# Altium schematic sheet RADC-CANBUS-S03-V00.SchDoc: RADC CANBUS (CAN2.0B, ESD Protection, LED Indicators)
size A3; DrawnBy: Jonn Dillon; DocumentNumber: 7; SheetNumber: 7; SheetTotal: 8; Version: 00; Project: QUTMS RADIO COMPUTE; PageSetup: Record=PageOptions|CenterHorizontal=True|CenterVertical=True|PrintScale=0.97|XCorrection=1.00|YCorrection=1.00|PrintKind=0|BorderSize=5000000|LeftOffset=0|BottomOffset=0|Orientation=2|PaperLength=1000|PaperWidth=1000|Scale=100|PaperSource=7|PrintQuality=-4|MediaType=1|DitherType=10|PaperKind=A4|PrintScaleMode=1
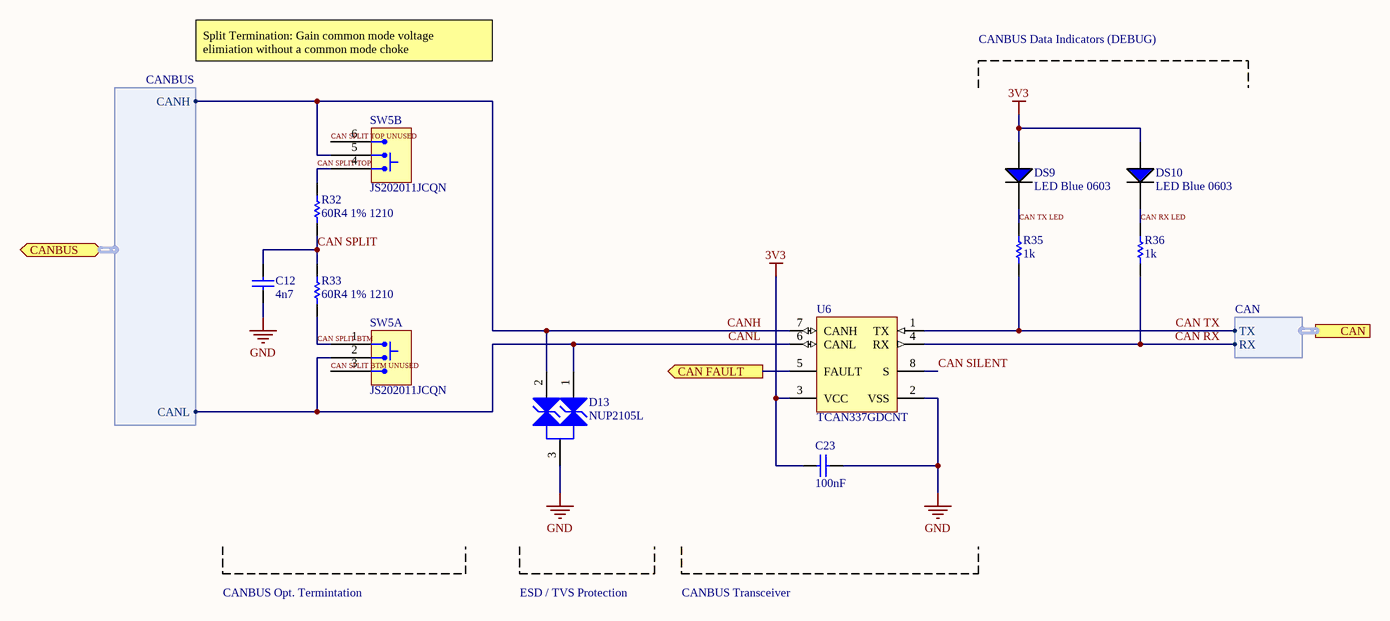
[diagram p0: RADC-CANBUS-S03-V00.SchDoc]

## Parts
C12  4n7  [Cap_Ceramic_0603]
C23  100nF  [Cap_Ceramic_0603]
D13  NUP2105L  [NUP2105L]
DS9  LED Blue 0603  [LED BLUE 0603]
DS10  LED Blue 0603  [LED BLUE 0603]
R32  60R4 1% 1210  [Res_ThinFilm_1210]
R33  60R4 1% 1210  [Res_ThinFilm_1210]
R35  1k  [Res_ThinFilm_0603]
R36  1k  [Res_ThinFilm_0603]
SW5  JS202011JCQN  [JS202011JCQN]  (parts A,B of 2)
U6  TCAN337GDCNT  [SOT-23-8]

## Ports
CAN (harness CAN), CAN FAULT (out), CANBUS (bidir, harness CANBUS)

## Harnesses
CAN: RX, TX
CANBUS: CANH, CANL

## Nets
3V3: C23.1 DS9.1(A) DS10.1(A) U6.3(VCC)
GND: C12.1 C23.2 D13.3 U6.2(VSS)
CAN FAULT: U6.5(FAULT) ; port CAN FAULT
CAN RX: R36.1 U6.4(RX) ; port CAN.RX
CAN RX LED: DS10.2(C) R36.2
CAN SILENT: U6.8(S)
CAN SPLIT: C12.2 R32.1 R33.2
CAN SPLIT BTM: R33.1 SW5.1
CAN SPLIT BTM UNUSED: SW5.3
CAN SPLIT TOP: R32.2 SW5.4
CAN SPLIT TOP UNUSED: SW5.6
CAN TX: R35.1 U6.1(TX) ; port CAN.TX
CAN TX LED: DS9.2(C) R35.2
CANH: D13.2 SW5.5 U6.7(CANH) ; port CANBUS.CANH
CANL: D13.1 SW5.2 U6.6(CANL) ; port CANBUS.CANL

## Notes on the sheet
- Split Termination: Gain common mode voltage elimiation without a common mode choke
- CANBUS Data Indicators (DEBUG)
- CANBUS Opt. Termintation
- ESD / TVS Protection
- CANBUS Transceiver
- Revision History:
- Sheet Title:
- Rev
- Date
- Description
- Project:
- Size:
- Drawn By:
- A3
- Number:
- Revision:
- Sheet
- Version:
- of
- QUT Motorsport
- O-120, Gardens Point
- 2 George Street
- Brisbane, QLD 4000
- Australia
- Print Date:
- Print Time:
- File Name:

## Library data of the parts
C12 = 4n7 50V 5% X7R 0603: Capacitor, Ceramic, SMD, 4n7, 50V, 5%, X7R, 0603
C23 = 100nF 50V 5% X7R 0603: Capacitor, Ceramic, SMD, 100nF, 50V, 5%, X7R, 0603
R32 R33 = 60R4 1% 1210: Resistor, SMD, 60R4, 0.25W, 1%, 1210
R35 R36 = 1k 5% 0603: Resistor, SMD, 1k, 0.1W, 5%, 0603
SW5 = SLIDE DPDT JS202011JCQN
U6 = TCAN337GDCNT: 1/1 Transceiver CANbus SOT-23-8
D13 = NUP2105L: ComponentLink1Description: Datasheet; ComponentLink1URL: https://www.onsemi.cn/PowerSolutions/document/NUP2105L-D.PDF; Parameter 1: *; ComponentLink2Description: LCSC; ComponentLink2URL: https://lcsc.com/product-detail/TVS_ON-Semiconductor-NUP2105LT1G_C14486.html; ComponentLink3Description: Digikey; ComponentLink3URL: https://www.digikey.com.au/product-detail/en/on-semiconductor/SZNUP2105LT1G/SZNUP2105LT1GOSCT-ND/3487669